# Altium schematic sheet DC075B_DECOUPLING.SchDoc: DECOUPLING
size 558 x 431 mm; DrawnBy: Praveen Aroul; DocumentNumber: 7; SheetNumber: 7; SheetTotal: 13; PageSetup: Record=PageOptions|CenterHorizontal=True|CenterVertical=True|PrintScale=1.00|XCorrection=1.00|YCorrection=1.00|PrintKind=0|BorderSize=5000000|LeftOffset=0|BottomOffset=0|Orientation=2|PaperLength=1000|PaperWidth=1000|Scale=100|PaperSource=15|PrintQuality=600|MediaType=1|DitherType=10|PaperKind=Letter|PrintScaleMode=1
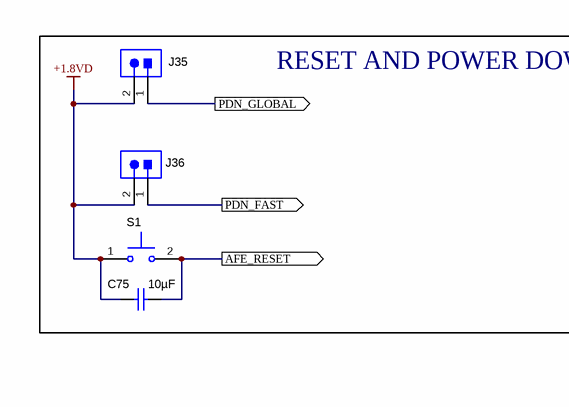
[diagram p0: DC075B_DECOUPLING.SchDoc, top left]
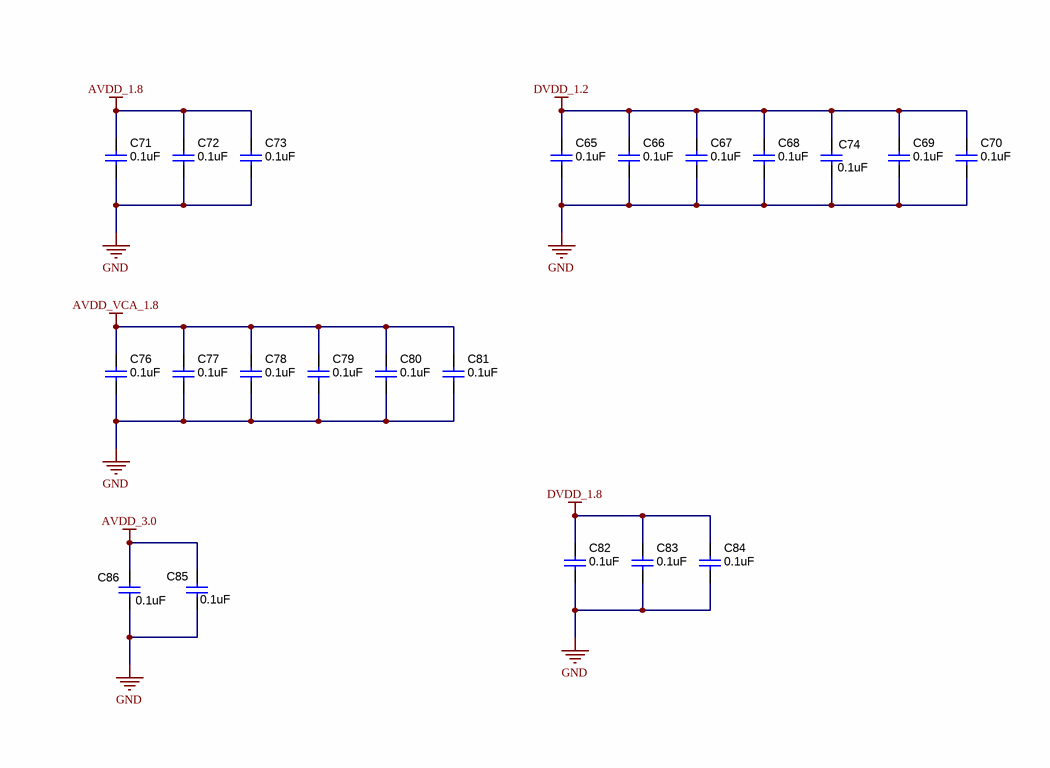
[diagram p1: DC075B_DECOUPLING.SchDoc, top right]
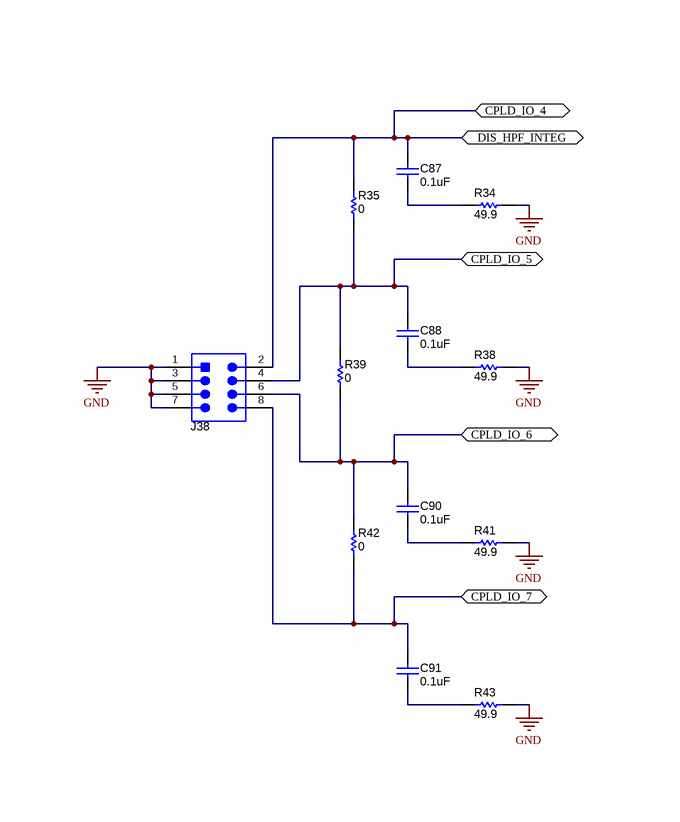
[diagram p2: DC075B_DECOUPLING.SchDoc, bottom left]
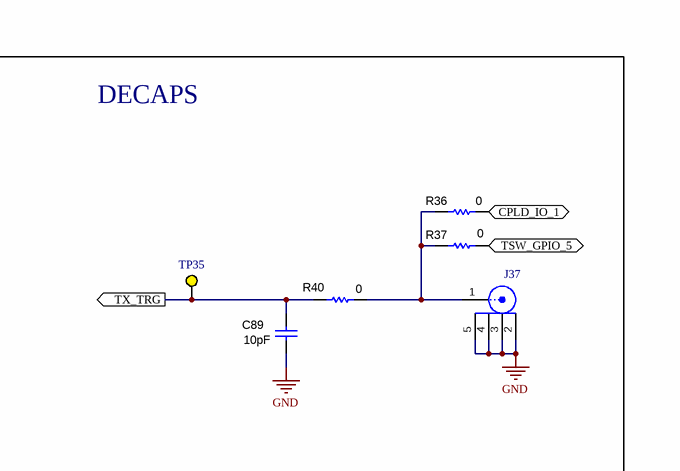
[diagram p3: DC075B_DECOUPLING.SchDoc, bottom right]

## Parts
C65  value 0.1uF  [0402]  (hidden comment: Capacitor)
C66  value 0.1uF  [0402]  (hidden comment: Capacitor)
C67  value 0.1uF  [0402]  (hidden comment: Capacitor)
C68  value 0.1uF  [0402]  (hidden comment: Capacitor)
C69  value 0.1uF  [0402]  (hidden comment: Capacitor)
C70  value 0.1uF  [0402]  (hidden comment: Capacitor)
C71  value 0.1uF  [0402]  (hidden comment: Capacitor)
C72  value 0.1uF  [0402]  (hidden comment: Capacitor)
C73  value 0.1uF  [0402]  (hidden comment: Capacitor)
C74  value 0.1uF  [0402]  (hidden comment: Capacitor)
C75  ValueDisplayed: 10µF  [0805_HV]  (hidden comment: CC0805ZKY5V6BB106)
C76  value 0.1uF  [0402]  (hidden comment: Capacitor)
C77  value 0.1uF  [0402]  (hidden comment: Capacitor)
C78  value 0.1uF  [0402]  (hidden comment: Capacitor)
C79  value 0.1uF  [0402]  (hidden comment: Capacitor)
C80  value 0.1uF  [0402]  (hidden comment: Capacitor)
C81  value 0.1uF  [0402]  (hidden comment: Capacitor)
C82  value 0.1uF  [0402]  (hidden comment: Capacitor)
C83  value 0.1uF  [0402]  (hidden comment: Capacitor)
C84  value 0.1uF  [0402]  (hidden comment: Capacitor)
C85  value 0.1uF  [0402]  (hidden comment: Capacitor)
C86  value 0.1uF  [0402]  (hidden comment: Capacitor)
C87  value 0.1uF  [0402]  (hidden comment: Capacitor)
C88  value 0.1uF  [0402]  (hidden comment: Capacitor)
C89  value 10pF  [0402]  (hidden comment: Capacitor)
C90  value 0.1uF  [0402]  (hidden comment: Capacitor)
C91  value 0.1uF  [0402]  (hidden comment: Capacitor)
J35  Header_2x1  [TSW-102-07-G-S]  (value not drawn)
J36  Header_2x1  [TSW-102-07-G-S]  (value not drawn)
J37  5-1814832-1  [TE_5-1814832-1]  (value not drawn)
J38  Header_4x2  [TSW-104-07-G-D]  (value not drawn)
R34  ValueDisplayed: 49.9  [0402]  (hidden comment: Resistor)
R35  value 0  [0402]  (hidden comment: Resistor)
R36  value 0  [0402]  (hidden comment: Resistor)
R37  value 0  [0402]  (hidden comment: Resistor)
R38  ValueDisplayed: 49.9  [0402]  (hidden comment: Resistor)
R39  value 0  [0402]  (hidden comment: Resistor)
R40  value 0  [0402]  (hidden comment: Resistor)
R41  ValueDisplayed: 49.9  [0402]  (hidden comment: Resistor)
R42  value 0  [0402]  (hidden comment: Resistor)
R43  ValueDisplayed: 49.9  [0402]  (hidden comment: Resistor)
S1  SKRKAEE020  [SW_SKRKAE]  (value not drawn)
TP35  5004  [Keystone5004]  (value not drawn)

## Blocks framed on the sheet
RESET AND POWER DOWN CONTROLS: C75 J35 J36 S1
DECAPS: C89 J37 R36 R37 R40 TP35

## Ports
AFE_RESET (out), CPLD_IO_1 (in), CPLD_IO_4 (bidir), CPLD_IO_5, CPLD_IO_6, CPLD_IO_7, DIS_HPF_INTEG (bidir), PDN_FAST (out), PDN_GLOBAL (out), TSW_GPIO_5, TX_TRG (out)

## Nets
+1.8VD: C75.1 J35.2 J36.2 S1.1
AVDD_1.8: C71.1 C72.1 C73.1
AVDD_3.0: C85.1 C86.1
AVDD_VCA_1.8: C76.1 C77.1 C78.1 C79.1 C80.1 C81.1
DVDD_1.2: C65.1 C66.1 C67.1 C68.1 C69.1 C70.1 C74.1
DVDD_1.8: C82.1 C83.1 C84.1
GND: C65.2 C66.2 C67.2 C68.2 C69.2 C70.2 C71.2 C72.2 C73.2 C74.2 C76.2 C77.2 C78.2 C79.2 C80.2 C81.2 C82.2 C83.2 C84.2 C85.2 C86.2 C89.1 J37.2 J37.3 J37.4 J37.5 J38.1 J38.3 J38.5 J38.7 R34.1 R38.1 R41.1 R43.1
AFE_RESET: C75.2 S1.2 ; port AFE_RESET
CPLD_IO_1: R36.1 ; port CPLD_IO_1
CPLD_IO_4: C87.1 J38.2 R35.2 ; port DIS_HPF_INTEG, port CPLD_IO_4
CPLD_IO_5: C88.1 J38.4 R35.1 R39.2 ; port CPLD_IO_5
CPLD_IO_6: C90.1 J38.6 R39.1 R42.2 ; port CPLD_IO_6
CPLD_IO_7: C91.1 J38.8 R42.1 ; port CPLD_IO_7
PDN_FAST: J36.1 ; port PDN_FAST
PDN_GLOBAL: J35.1 ; port PDN_GLOBAL
TSW_GPIO_5: R37.1 ; port TSW_GPIO_5
TX_TRG: C89.2 R40.2 TP35.1 ; port TX_TRG
NetC87_2: C87.2 R34.2
NetC88_2: C88.2 R38.2
NetC90_2: C90.2 R41.2
NetC91_2: C91.2 R43.2
NetJ37_1: J37.1 R36.2 R37.2 R40.1

## Notes on the sheet
- Drawn By:
- SVN Rev:
- Number:
- TID #:
- Orderable:
- Rev:
- Sheet Title:
- File:
- Project Title:
- Designed for:
- Assembly Variant:
- Mod. Date:
- Sheet:
- Size:
- of
- C
- http://www.ti.com
- Texas Instruments and/or its licensors do not warrant the accuracy or completeness of this specification or any information contained therein. Texas Instruments and/or its licensors do not warrant that this design will meet the specifications, will be suitable for your application or fit for any particular purpose, or will operate in an implementation. Texas Instruments and/or its licensors do not warrant that the design is production worthy. You should completely validate and test your design implementation to confirm the system functionality for your application.
- Engineer:
- Contact:
- © Texas Instruments

## Library data of the parts
C65-C74 C76-C88 C90 C91 = CMP-0006641-2: CAP, CERM, 0.1 uF, 16 V, +/- 10%, X7R, 0402; PartNumber: GRM155R71C104KA88D; Manufacturer: MuRata; Polarized: N; U/M: EA; Cap_F: 100nF; Value1: Unknown; VDC_V: 16V; TaMin_C: -55°C; TaMax_C: 125°C; AEC Category: Q200; SizeArea_mm2: 0.5; SizeAreaWB_mm2: 3; SizeX_mm: 1; SizeZ_mm: 0.6; CompType: Capacitor; PackageReference: 0402; RoHS: Y; MountType: SMT; ComponentLink1Description: Datasheet link; ComponentLink1URL: http://search.murata.co.jp/Ceramy/PnsearchViewAction.do?HnOFG=ON&HnNFG=ON&SEL_CNT=50&sLang=en&sKey=GRM155R71C104KA88D&x=9&y=9&search=startwith; ValueDisplayed: 0.1uF; Tolerance_%: 10%; Value2: 16V; Technology: Ceramic; TempCo: X7R; Cap_Case: 0402; Published: 2008-06-19; Publisher: Texas Instruments; LatestRevisionDate: 2017-03-09; Supplier 1: Digi-Key; Supplier Part Number 1: 490-3261-1-ND; Supplier 2: Newark; Supplier Part Number 2: 38K1647; Supplier 3: Mouser; Supplier Part Number 3: 81-GRM155R71C104KA88; AEC Qualified: ?; SizeY_mm: 0.5
C75 = CMP-0085574-1: CAP, CERM, 10 µF, 10 V,+80/-20%, Y5V, 0805; Manufacturer: Yageo; CompType: Capacitor; AEC Category: Q200; Cap_Case: 0805; SizeY_mm: 1.25; AEC Qualified: N; SizeX_mm: 2; Tolerance_%: 80%; TaMax_C: 85°C; TaMin_C: -30°C; Green_Lifecycle: Active; Green_REACh: Incomplete; VDC_V: 10V; Value: 10uF; U/M: EA; SizeAreaWB_mm2: 6.75; SizeZ_mm: 1.45; SizeArea_mm2: 2.5; ComponentLink1URL: http://www.yageo.com/documents/recent/UPY-GPHC_Y5V_6.3V-to-50V_8.pdf; TempCo: Y5V; MountType: SMT; PartNumber: CC0805ZKY5V6BB106; AEC Grade: N/A; Green_EU RoHS-2: Passed; ComponentLink1Description: Datasheet link; Technology: Ceramic; RoHS: Y; Green_EU RoHS: Passed; Cap_F: 10µF; Polarized: N; Value2: 10V; PackageReference: 0805
C89 = CMP-0006408-2: CAP, CERM, 10 pF, 50 V, +/- 5%, C0G/NP0, 0402; PartNumber: GRM1555C1H100JA01D; Manufacturer: MuRata; Polarized: N; U/M: EA; Value1: Unknown; VDC_V: 50V; TaMin_C: -55°C; TaMax_C: 125°C; AEC Category: Q200; SizeArea_mm2: 0.5; SizeAreaWB_mm2: 3; SizeX_mm: 1; SizeZ_mm: 0.6; CompType: Capacitor; PackageReference: 0402; RoHS: Y; MountType: SMT; ComponentLink1Description: Datasheet link; ComponentLink1URL: http://search.murata.co.jp/Ceramy/PnsearchViewAction.do?HnOFG=ON&HnNFG=ON&SEL_CNT=50&sLang=en&sKey=GRM1555C1H100JA01D&x=9&y=9&search=startwith; ValueDisplayed: 10pF; Cap_F: 10pF; Tolerance_%: 5%; Value2: 50V; Technology: Ceramic; TempCo: C0G/NP0; Cap_Case: 0402; Published: 2008-06-19; Publisher: Texas Instruments; LatestRevisionDate: 2017-03-09; Supplier 1: Mouser; Supplier Part Number 1: 81-GRM1555C1H100JA1D; AEC Qualified: ?; SizeY_mm: 0.5
J35 J36 = CMP-0075405-2: Header, 100mil, 2x1, Gold, TH; Manufacturer: Samtec; Cert_CSA: Y; Cert_CULUS: N; Current_A: 6.3A; Gender: Male; Green_Lifecycle: Active; Green_REACh: Passed; Pitch_mm: 2.54; Row_Count: 1; Voltage_V: 550V; PartNumber: TSW-102-07-G-S; ClassName: Header; PackageReference: 2x1 Header; CompType: Header; RoHS: Y; MountType: TH; ComponentLink1Description: Datasheet URL; ComponentLink1URL: http://samtec.com/ftppub/pdf/TSW_TH.PDF; Supplier 1: Digi-Key; Supplier Part Number 1: SAM1029-02-ND; Cert_UL: Y; Cert_VDE: N; Color: Black; ContactFinish: Gold; Green_EU RoHS-2: Passed; Green_EU RoHS: Passed; Orientation: Vertical; PinCount: 2; Shrouded: N
J37 = CMP-0054990-1: SMA Straight PCB Socket Die Cast, 50 Ohm, TH; Manufacturer: TE Connectivity; Green_Lifecycle: Active; Green_REACh: Passed; CNHeader: FALSE; CT: TRUE; PartNumber: 5-1814832-1; PackageReference: SMA Straight PCB Socket Die Cast, TH; CompType: SMA; RoHS: Y; MountType: TH; ComponentLink1Description: Datasheet URL; ComponentLink1URL: http://www.te.com/commerce/DocumentDelivery/DDEController?Action=srchrtrv&DocNm=1814832&DocType=Customer+Drawing&DocLang=English; Supplier 1: Digi-Key; Supplier Part Number 1: A97594-ND; Supplier 2: Newark; Supplier Part Number 2: 78M7270; Supplier 3: Mouser; Supplier Part Number 3: 571-5-1814832-1; Green_EU RoHS-2: Incomplete; Green_EU RoHS: Passed with Exemption; Publisher: Texas Instruments; LatestRevisionDate: 26/05/2017
J38 = CMP-0075408-2: Header, 100mil, 4x2, Gold, TH; Manufacturer: Samtec; Cert_CSA: Y; Cert_CULUS: N; Current_A: 6.3A; Gender: Male; Green_Lifecycle: Active; Green_REACh: Passed; Pitch_mm: 2.54; Row_Count: 2; Voltage_V: 550V; PartNumber: TSW-104-07-G-D; PackageReference: 4x2 Header; ClassName: Header; CompType: Header; RoHS: Y; MountType: TH; ComponentLink1Description: Datasheet URL; ComponentLink1URL: http://samtec.com/ftppub/pdf/TSW_TH.PDF; Supplier 1: Digi-Key; Supplier Part Number 1: SAM1028-04-ND; Cert_UL: Y; Cert_VDE: N; Color: Black; ContactFinish: Gold; Green_EU RoHS-2: Passed; Green_EU RoHS: Passed; Orientation: Vertical; PinCount: 8; RowSpacing_mm: 2.54; Shrouded: N
R34 R38 R41 R43 = CMP-0026404-2: RES, 49.9, 1%, 0.063 W, AEC-Q200 Grade 0, 0402; Manufacturer: Vishay-Dale; PartNumber: CRCW040249R9FKED; Value: 49.9; Value_Code: 49R9; Power_W: 63mW; Value2: 0.063W; VDC_V: 50V; TempCo: 100 ppm/C; EIA_Code: E96; AEC Category: Q200; AEC Grade: 0; AEC Qualified: Y; SizeArea_mm2: 0.5; SizeX_mm: 1; SizeZ_mm: 0.6; ComponentLink1Description: Datasheet link; ComponentLink1URL: http://www.vishay.com/docs/20035/dcrcwe3.pdf; CompType: Resistor; MountType: SMT; PackageReference: 0402; RoHS: E; Res_ohm: 49.9; Tolerance_%: 1%; Value1: 1%; Technology: Thick Film; Supplier 1: Digi-Key; Supplier Part Number 1: 541-49.9LCT-ND; Supplier 2: Newark; Supplier Part Number 2: 52K7114; Supplier 3: Mouser; Supplier Part Number 3: 71-CRCW0402-49.9-E3; SizeY_mm: 0.5
R35-R37 R39 R40 R42 = CMP-0026822-3: RES, 0, 5%, 0.063 W, AEC-Q200 Grade 0, 0402; Manufacturer: Vishay-Dale; PartNumber: CRCW04020000Z0ED; Value_Code: 0000; Power_W: 63mW; Value2: 0.063W; VDC_V: 50V; TempCo: 200 ppm/C; EIA_Code: E24; AEC Category: Q200; AEC Qualified: Y; SizeArea_mm2: 0.5; SizeX_mm: 1; SizeZ_mm: 0.6; ComponentLink1Description: Datasheet link; ComponentLink1URL: http://www.vishay.com/docs/20035/dcrcwe3.pdf; CompType: Resistor; MountType: SMT; PackageReference: 0402; RoHS: E; ValueDisplayed: 0; Res_ohm: 0; Tolerance_%: 5%; Value1: 5%; Technology: Thick Film; Supplier 1: Digi-Key; Supplier Part Number 1: 541-0.0JCT-ND; Supplier 2: Newark; Supplier Part Number 2: 52K6543; Supplier 3: Mouser; Supplier Part Number 3: 71-CRCW0402-0-E3; AEC Grade: 0; SizeY_mm: 0.5
S1 = CMP-0085606-1: Switch, SPST-NO, 0.05 A, 12 VDC, SMT; Manufacturer: Alps; VDC_V: 12V; PositionCount: 1; CurrentRating_mA: 50A; SizeArea_mm2: 13.92; SizeAreaWB_mm2: 22.62; SizeX_mm: 4.8; SizeY_mm: 2.9; SizeZ_mm: 2.2; PartNumber: SKRKAEE020; MountType: SMT; ComponentLink1Description: Datasheet URL; ComponentLink1URL: https://www.alps.com/prod/info/E/HTML/Tact/SurfaceMount/SKRK/SKRKAEE020.html; RoHS: Y; Circuit: SPST-NO; Orientation: Top Actuated; CompType: Switch; PackageReference: 3.9x2.9mm; Publisher: Texas Instruments; LatestRevisionDate: 2018-11-05
TP35 = CMP-0055141-1: Test Point, Miniature, Yellow, TH; Manufacturer: Keystone; CNHeader: FALSE; ContactFinish: Silver; CT: TRUE; Green_Lifecycle: Active; Green_REACh: Passed; PartNumber: 5004; PackageReference: Yellow Miniature Testpoint; CompType: Test Point; RoHS: Y; MountType: TH; ComponentLink1Description: Datasheet URL; ComponentLink1URL: http://www.keyelco.com/userAssets/file/M60-2p60.pdf; Publisher: Texas Instruments; LatestRevisionDate: 26/05/2017; Supplier 1: Digi-Key; Supplier Part Number 1: 36-5004-ND; Supplier 2: Mouser; Supplier Part Number 2: 534-5004; Color: Yellow; Green_EU RoHS-2: Incomplete; Green_EU RoHS: Passed